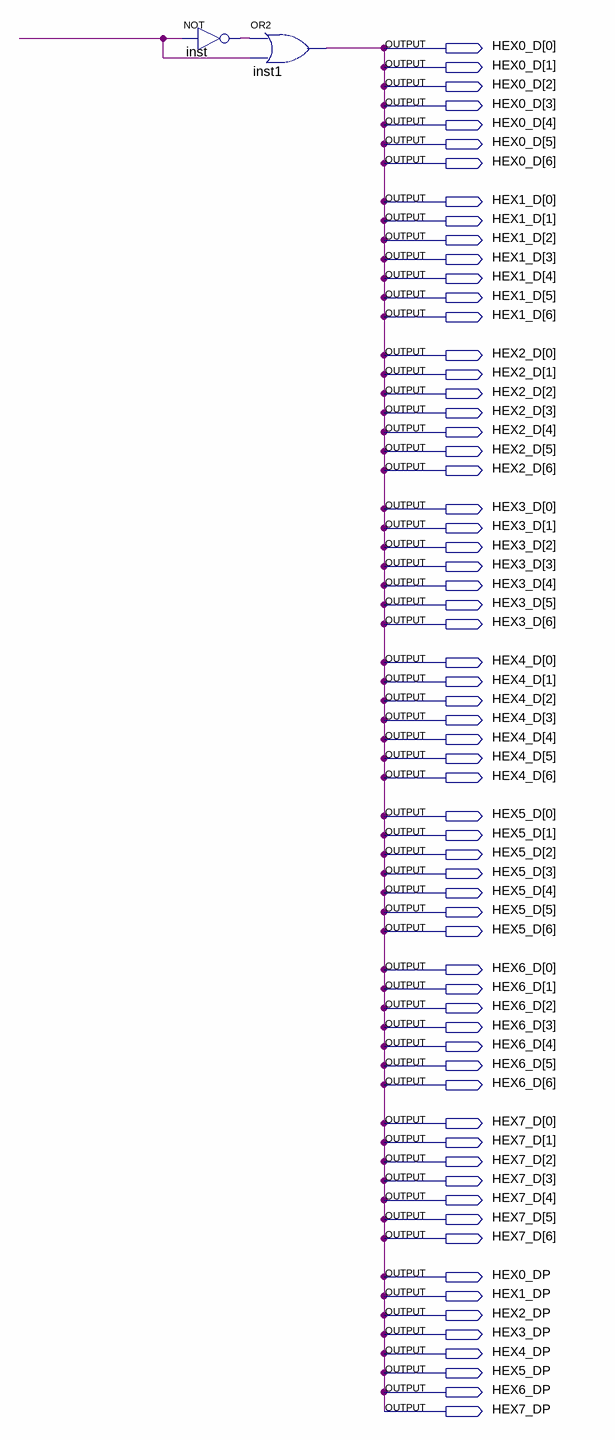
[diagram p0: schematic sheet]
// Quartus schematic apagadordisplays.bdf as structural Verilog: 2 symbols, 64 pins
module apagadordisplays (
  output [6:0] HEX0_D,
  output [6:0] HEX1_D,
  output [6:0] HEX2_D,
  output [6:0] HEX3_D,
  output [6:0] HEX4_D,
  output [6:0] HEX5_D,
  output [6:0] HEX6_D,
  output [6:0] HEX7_D,
  output HEX0_DP,
  output HEX1_DP,
  output HEX2_DP,
  output HEX3_DP,
  output HEX4_DP,
  output HEX5_DP,
  output HEX6_DP,
  output HEX7_DP
);

  wire inst_out, undriven;

  not inst (inst_out, undriven);
  or inst1 (HEX0_D[6], inst_out, undriven);

  assign HEX0_D[5:0] = {6{HEX0_D[6]}};
  assign HEX0_DP = HEX0_D[6];
  assign HEX1_D = {7{HEX0_D[6]}};
  assign HEX1_DP = HEX0_D[6];
  assign HEX2_D = {7{HEX0_D[6]}};
  assign HEX2_DP = HEX0_D[6];
  assign HEX3_D = {7{HEX0_D[6]}};
  assign HEX3_DP = HEX0_D[6];
  assign HEX4_D = {7{HEX0_D[6]}};
  assign HEX4_DP = HEX0_D[6];
  assign HEX5_D = {7{HEX0_D[6]}};
  assign HEX5_DP = HEX0_D[6];
  assign HEX6_D = {7{HEX0_D[6]}};
  assign HEX6_DP = HEX0_D[6];
  assign HEX7_D = {7{HEX0_D[6]}};
  assign HEX7_DP = HEX0_D[6];
endmodule
